# EasyEDA schematic schematics_easyEDA.json

## Sheets
1 Battery Hot Swap: TITLE: Battery Hot Swap; REV: 0.2; Date: 2021-07-21; Sheet: 1/1; Drawn By: ykompis; Company: V4RL
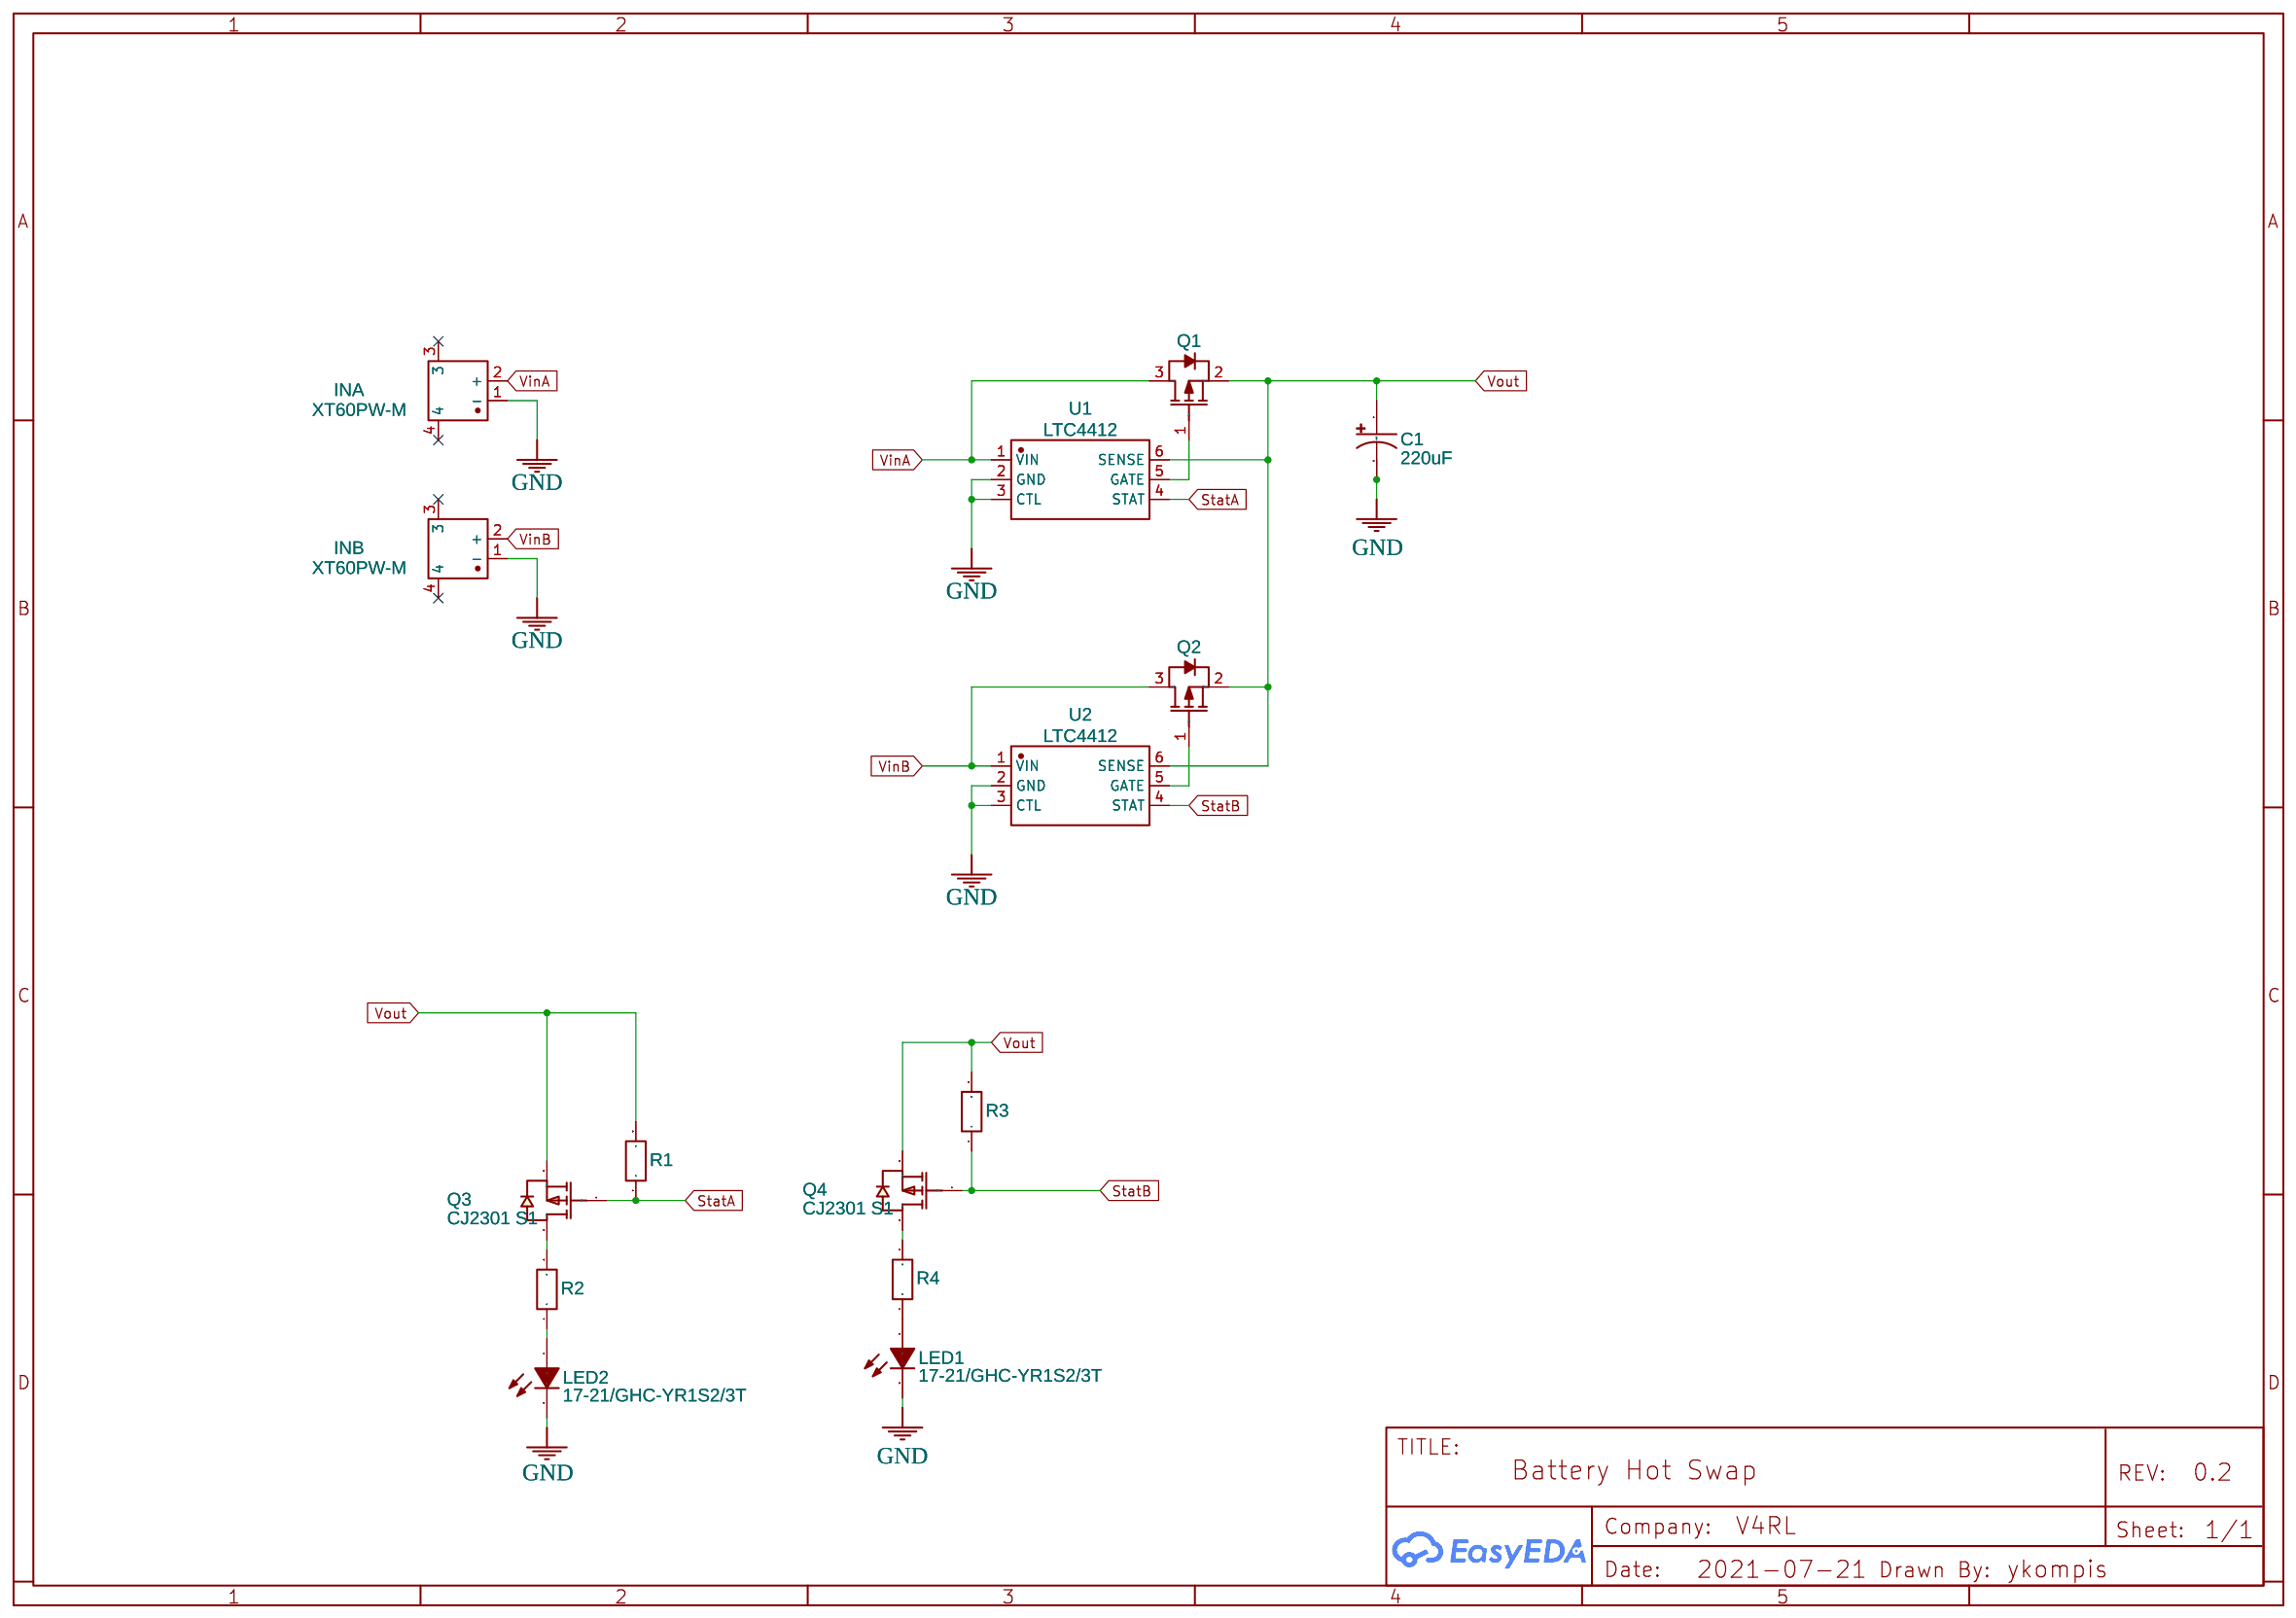
[diagram p0: Battery Hot Swap]
2 12V Distribution: TITLE: 12V Distribution; REV: 1.0; Date: 2021-08-04
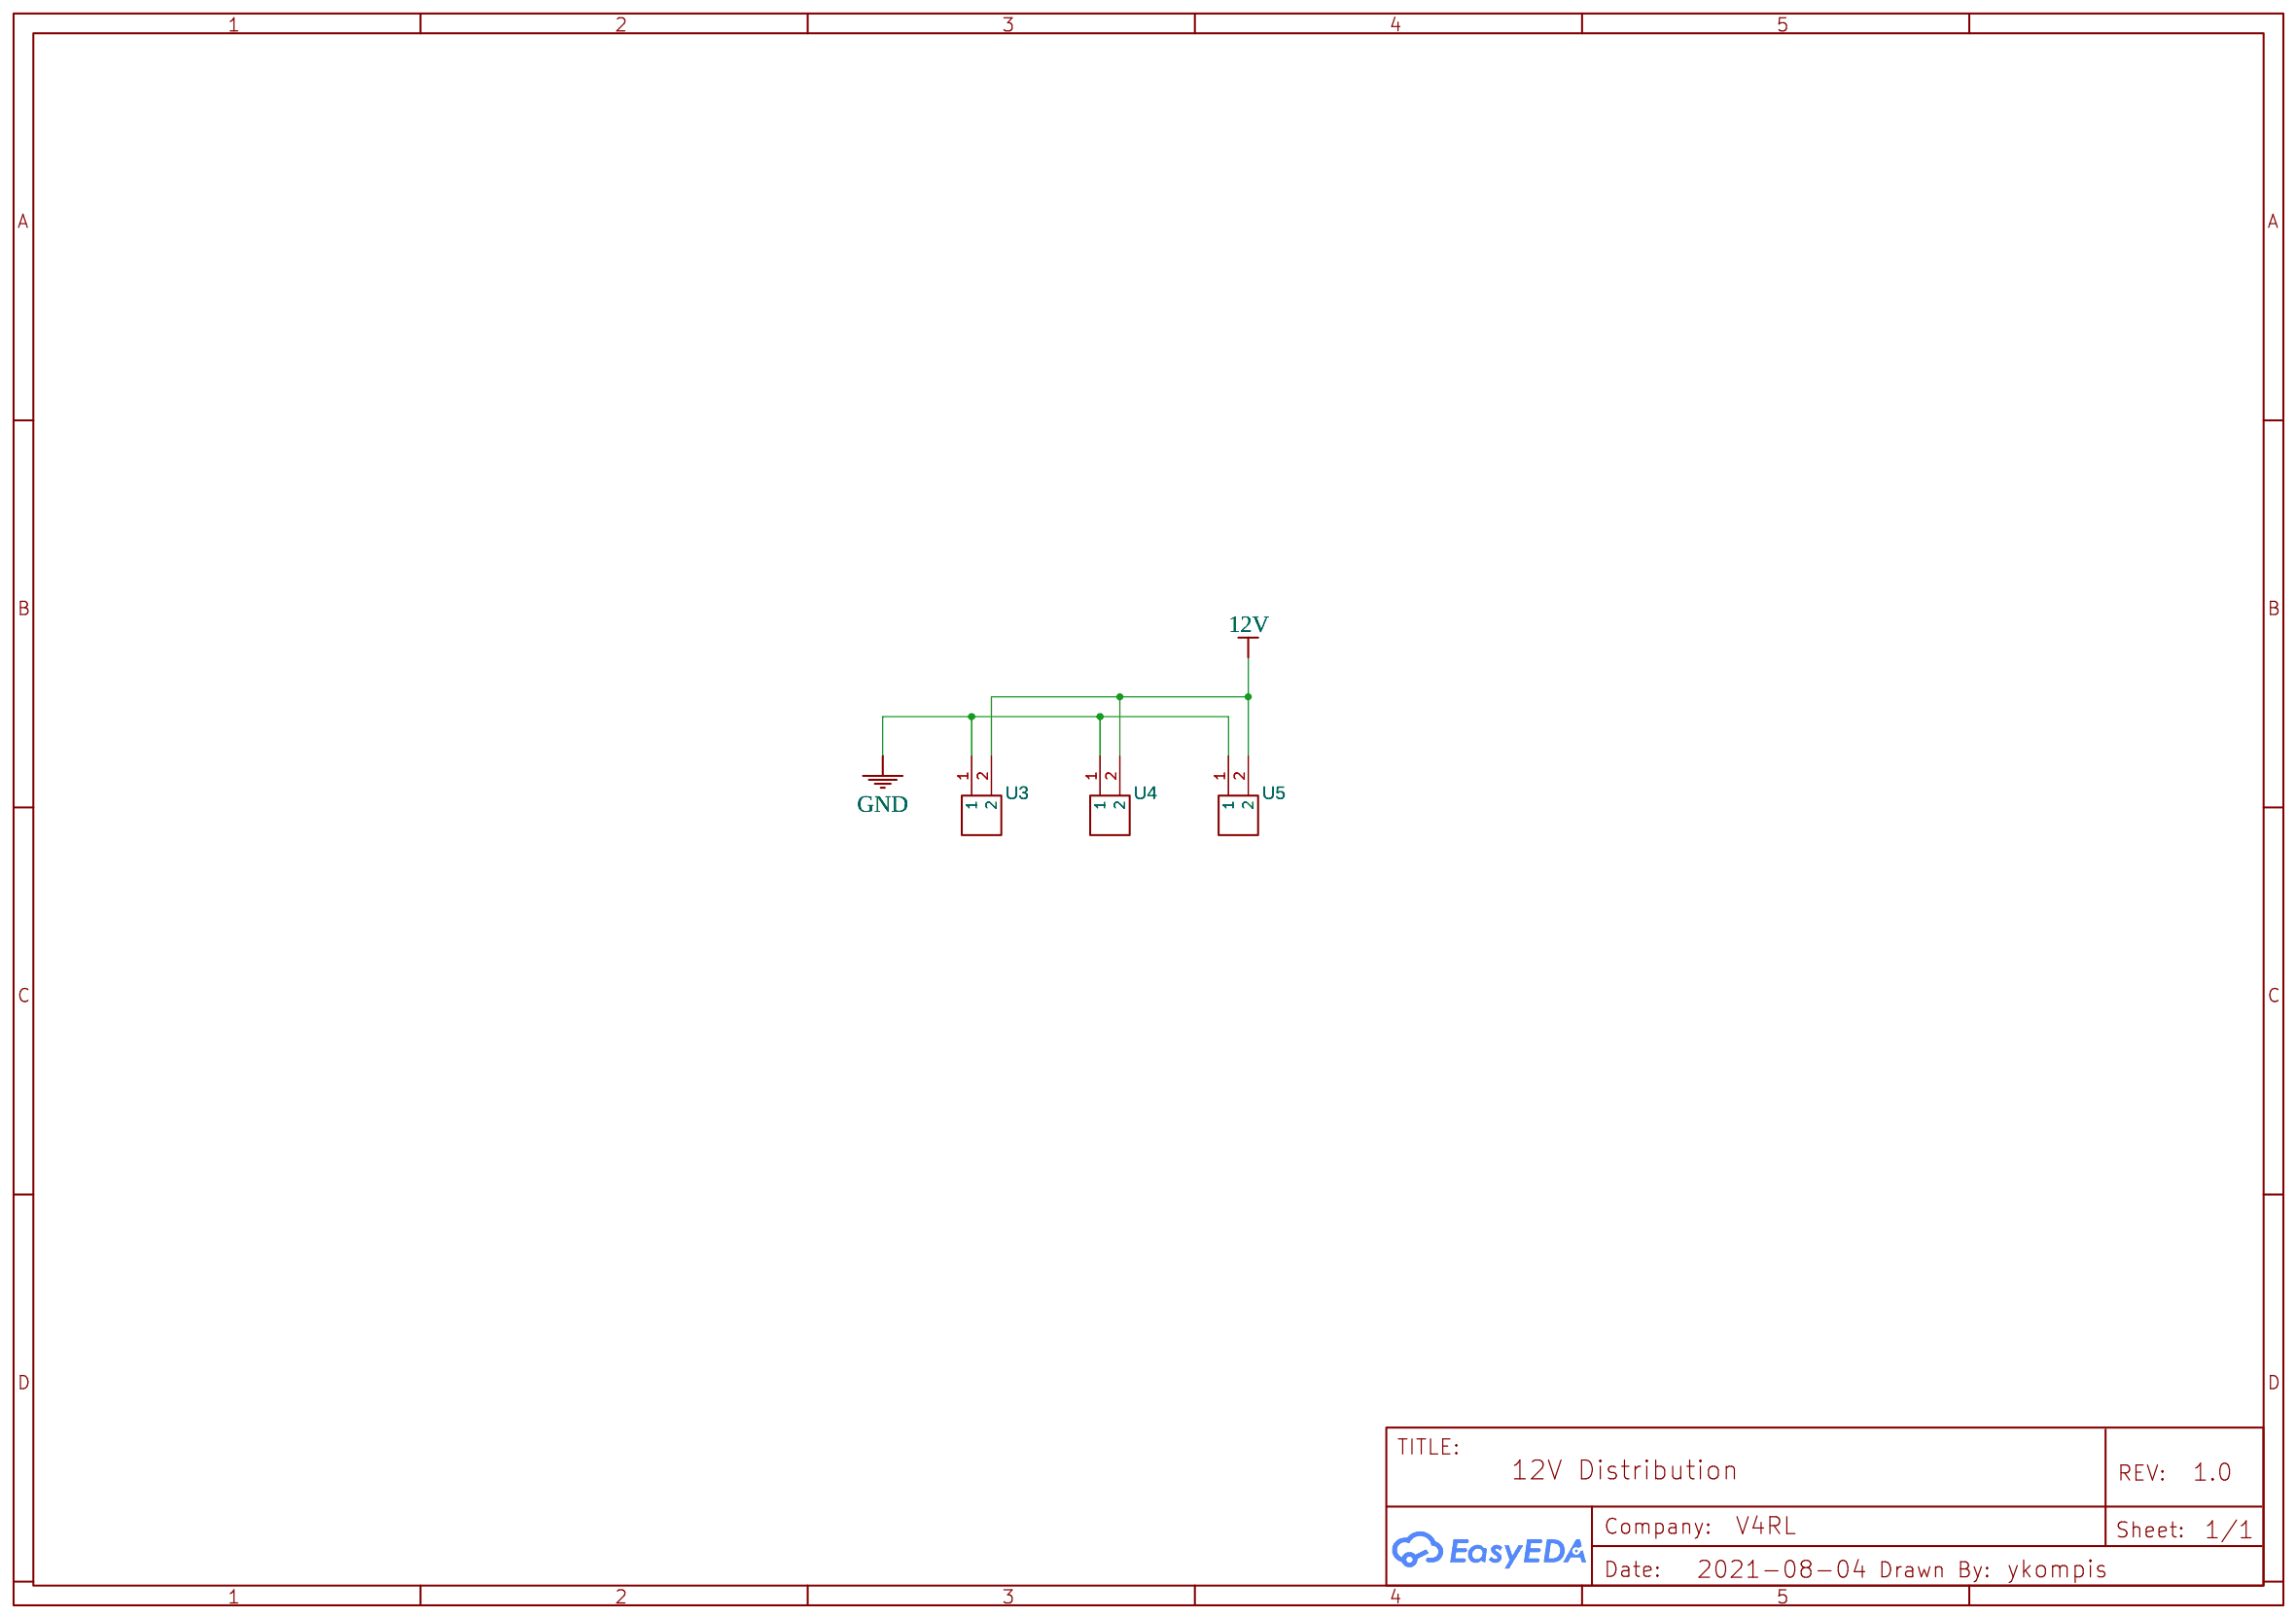
[diagram p1: 12V Distribution]

## Parts
sheet 12V Distribution
U3  MOLEX 430450200  [CONN-TH_43045-0200]
U4  MOLEX 430450200  [CONN-TH_43045-0200]
U5  MOLEX 430450200  [CONN-TH_43045-0200]
sheet Battery Hot Swap
C1  220uF  [CAP-SMD_BD10.0-L10.3-W10.3-FD]
INA  XT60PW-M  [CONN-TH_XT60PW-M]
INB  XT60PW-M  [CONN-TH_XT60PW-M]
LED1  17-21/GHC-YR1S2/3T  [LED0805-R-RD]
LED2  17-21/GHC-YR1S2/3T  [LED0805-R-RD]
Q1  FDD4685  [TO-252-2_L6.6-W6.1-P4.57-LS9.9-BR]
Q2  FDD4685  [TO-252-2_L6.6-W6.1-P4.57-LS9.9-BR]
Q3  CJ2301 S1  [SOT-23-3_L3.0-W1.7-P0.95-LS2.9-BR]
Q4  CJ2301 S1  [SOT-23-3_L3.0-W1.7-P0.95-LS2.9-BR]
R1  ARG05DTC1000  [R0805]
R2  ARG05DTC1000  [R0805]
R3  ARG05DTC1000  [R0805]
R4  ARG05DTC1000  [R0805]
U1  LTC4412  [TSOT-23-6_L2.9-W1.6-P0.95-LS2.8-BR]
U2  LTC4412  [TSOT-23-6_L2.9-W1.6-P0.95-LS2.8-BR]

## Library data of the parts
U3-U5 = MOLEX 430450200: Contributor: adinackerman
C1 = EEEFC1V221AP: Supplier: LCSC; Supplier Part: C401627; Manufacturer: PANASONIC; Contributor: LCSC
INA INB = XT60PW-M: Supplier: LCSC; Supplier Part: C98732; Manufacturer: AMASS(艾迈斯); JLCPCB Part Class: Extended Part; Contributor: LCSC
LED1 LED2 = 17-21/GHC-YR1S2/3T: Supplier: LCSC; Manufacturer: EVERLIGHT; Supplier Part: C73546; JLCPCB Part Class: Extended Part
Q1 Q2 = FDD4685: Supplier: LCSC; Supplier Part: C258227; Manufacturer: ON Semicon; Contributor: LCSC; JLCPCB Part Class: Extended Part
Q3 Q4 = CJ2301 S1: Supplier: LCSC; Manufacturer: CJ; Supplier Part: C8547; JLCPCB Part Class: Extended Part
R1-R4 = ARG05DTC1000: Supplier: LCSC; Supplier Part: C1509658; Manufacturer: 光颉(Viking); JLCPCB Part Class: Extended Part; Contributor: LCSC
U1 U2 = LTC4412ES6#TRPBF: Supplier: LCSC; Supplier Part: C514442; Manufacturer: Analog Devices; Contributor: LCSC; JLCPCB Part Class: Extended Part

## Nets
12V: U3.2 U4.2 U5.2
GND: C1.2 INA.1(-) INB.1(-) LED1.2(-) LED2.2(-) U1.2(GND) U1.3(CTL) U2.2(GND) U2.3(CTL) U3.1 U4.1 U5.1
VinA: INA.2(+) Q1.3(D) U1.1(VIN)
VinB: INB.2(+) Q2.3(D) U2.1(VIN)
StatA: Q3.1(G) R1.1 U1.4(STAT)
StatB: Q4.1(G) R3.1 U2.4(STAT)
Vout: C1.1 Q1.2(S) Q2.2(S) Q3.2(S) Q4.2(S) R1.2 R3.2 U1.6(SENSE) U2.6(SENSE)
Net-(LED1-1): LED1.1(+) R4.1
Net-(LED2-1): LED2.1(+) R2.1
Net-(Q1-1): Q1.1(G) U1.5(GATE)
Net-(Q2-1): Q2.1(G) U2.5(GATE)
Net-(Q3-3): Q3.3(D) R2.2
Net-(Q4-3): Q4.3(D) R4.2

Not connected (* = marked no-connect by the designer): INA 3* 4*; INB 3* 4*
